# Altium schematic sheet Power.SchDoc
size A4; PageSetup: Record=PageOptions|CenterHorizontal=True|CenterVertical=True|PrintScale=0.97|XCorrection=1.00|YCorrection=1.00|PrintKind=0|BorderSize=5000000|LeftOffset=0|BottomOffset=0|Orientation=2|PaperLength=1000|PaperWidth=1000|Scale=100|PaperSource=7|PrintQuality=-4|MediaType=1|DitherType=10|PaperKind=A4|PrintScaleMode=1
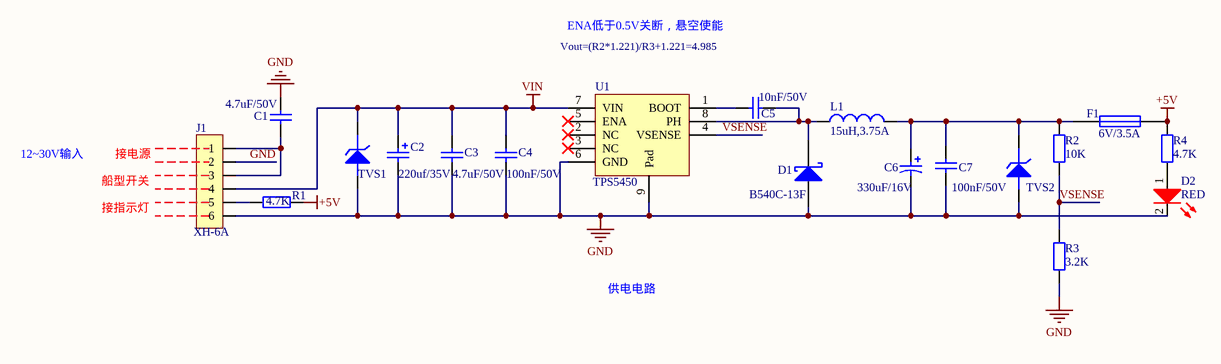
[diagram p0: Power.SchDoc]

## Parts
C1  4.7uF/50V  [0603C]
C2  220uf/35V  [CES-8x10R5mm]
C3  4.7uF/50V  [0603C]
C4  100nF/50V  [0603C]
C5  10nF/50V  [0603C]
C6  330uF/16V  [CES-8 X11R7MM]
C7  100nF/50V  [0603C]
D1  B540C-13F  [SMC]
D2  RED  [0603D]
F1  6V/3.5A  [F1812]
J1  XH-6A  [CN6-2.54]
L1  15uH,3.75A  [L12*12*6]
R1  4.7K  [0603R]
R2  10K  [0603R]
R3  3.2K  [0603R]
R4  4.7K  [0603R]
TVS1  1SMA26CAT3G  [DO-214AC]  (value not drawn)
TVS2  1SMA6.0AT3D  [DO-214AC]  (value not drawn)
U1  TPS5450  [SOIC8-P]

## Nets
+5V: F1.2 R1.1 R4.2
GND: C1.2 C2.2 C3.1 C4.1 C6.2 C7.1 D1.1 D2.2 J1.2 J1.6 R3.1 TVS1.1 TVS2.1 U1.6(GND) U1.9(Pad)
VIN: C2.1 C3.2 C4.2 J1.4 TVS1.2 U1.7(VIN)
VSENSE: R2.2 R3.2 U1.4(VSENSE)
NetC1_1: C1.1 J1.1 J1.3
NetC5_1: C5.1 U1.1(BOOT)
NetC5_2: C5.2 D1.2 L1.1 U1.8(PH)
NetC6_1: C6.1 C7.2 F1.1 L1.2 R2.1 TVS2.2
NetD2_1: D2.1 R4.1
NetJ1_5: J1.5 R1.2

Not connected (* = marked no-connect by the designer): U1 2(NC)* 3(NC)* 5(ENA)*

## Notes on the sheet
- Vout=(R2*1.221)/R3+1.221=4.985
- ENA低于0.5V关断，悬空使能
- 12~30V输入
- 船型开关
- 接指示灯
- 接电源
- 供电电路
- Shen Zhen Strong Technology Co,.LTD
- 深圳市思榕科技有限公司
- Title:
- PN:
- APPD（核准）:
- Date:
- CHK（审核）:
- DR（绘图）:
- Rev:
- Sheet:
- of

## Library data of the parts
C1 C3 = C4.7uF-0603: 瓷片电容,4.7uF,5%,X7R,50V,0603; 料号: 10201-47042-00; 品名: 瓷片电容
C2 = C220uf/35V-8*11.5: 铝电解电容,220uF,20%,35V,8*11.5; 料号: 10202-22069-00; 品名: 铝电解电容
C4 C7 = C100nF/50V-0603: 瓷片电容,100nF,5%,X7R,50V,0603; 料号: 10201-10032-00; 品名: 瓷片电容
C5 = C10nF/50V-0603: 瓷片电容,10nF,5%,X7R,50V,0603; 料号: 10201-10022-00; 品名: 瓷片电容
C6 = C330uF/16V-8*11.7: 铝电解电容，330uF/16V，8*11.7; 品名: 铝电解电容; 料号: 10202-3307G-00
D1 = B540C-13-F: 肖特基二极管, 40V/5A, SMC（DO-214AB）封装; 料号: 10403-00014-00; 品名: 肖特基二极管
D2 = LED-RED-0603: LED，红光，0603; 料号: 10406-00008-00; 品名: 发光二极管
F1 = F-6V/3.5A: 保险丝,6V,3.5A,慢断,1812封装; 料号: 11001-00023-00; 品名: 保险丝
J1 = CONN-XH-6A: CONN,XH-6A,6PIN,2.54mm插座; 料号: 10701-00013-00; 品名: 线对板连接器
L1 = L15uH-12*12*6: 744771115，15uH，±20%，3.75A，外形尺寸：12x12x6mm; 料号: 10301-01014-00; 品名: 功率电感
R1 R4 = R4.7K-0603: 金属膜电阻,4.7K,1%,1/10W,0603; 料号: 10101-47012-00; 品名: 金属膜电阻
R2 = R10K-0603-0.1%: 金属膜电阻,10K,0.1%,1/10W,0603; 料号: 10101-1002B-00; 品名: 金属膜电阻
R3 = R3.2K-0603-0.1%: 金属膜电阻,3.2KK,0.1%,1/10W,0603; 料号: 10101-03201-00; 品名: 金属膜电阻
TVS1 = 1SMA26CAT3G: TVS管，1SMA26CAT3G，DO214AC封装（SMA）; 料号: 10405-00033-00; 品名: TVS管
TVS2 = 1SMA6.0AT3D: TVS管，1SMA6.0AT3D，DO214AC封装（SMA）; 料号: 10405-00035-00; 品名: TVS管
U1 = TPS5450: 线性稳压器，SOIC-8封装，; 产品料号: 10604-00141-00; 品名: 电源芯片